# EAGLE design CortexM0 development board (EAGLE 9.6.2)
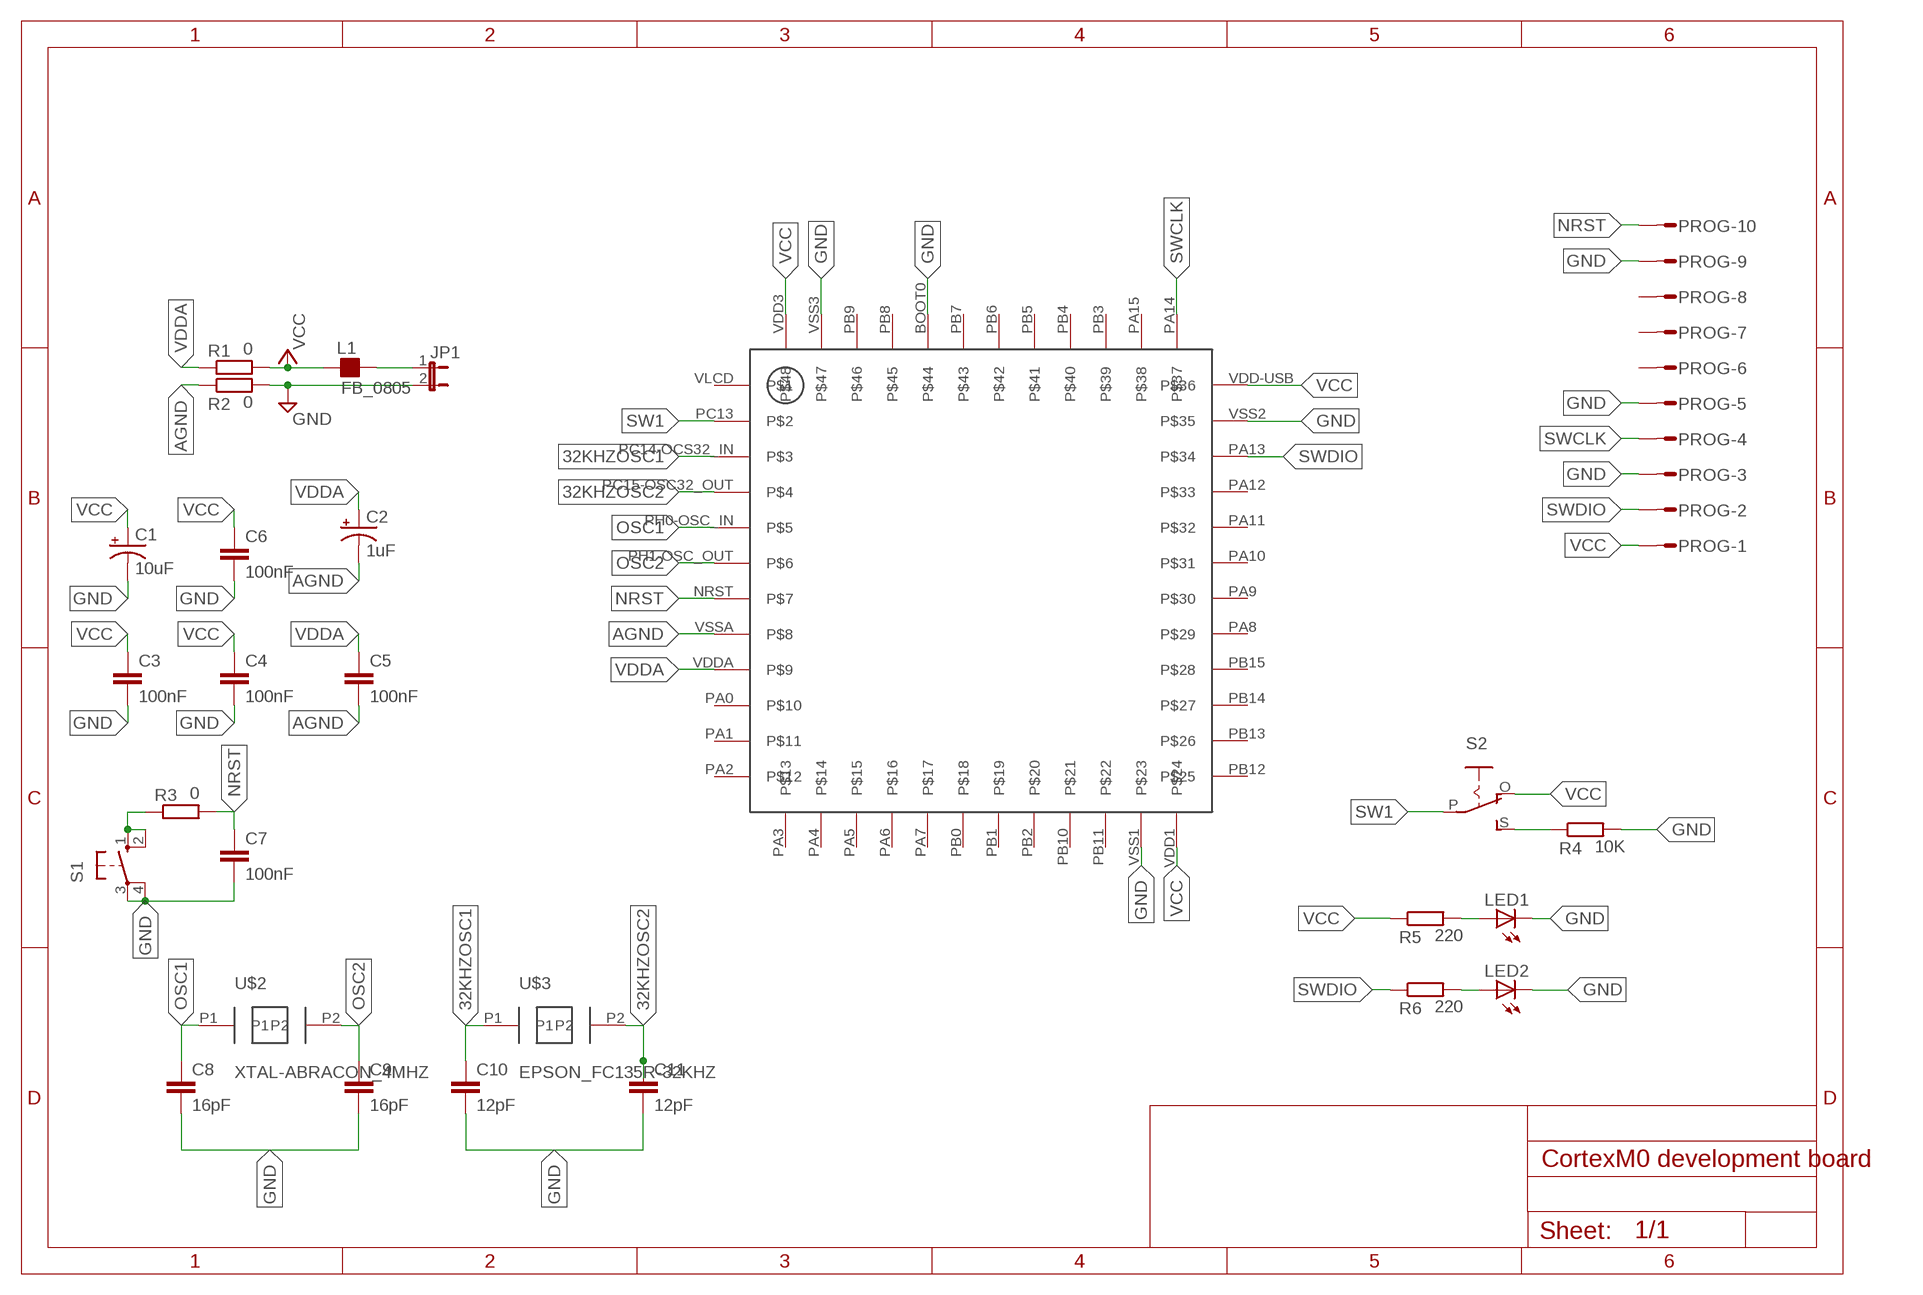
[diagram p0: schematic, sheet 1]

## Parts
C1  10uF  C-POL-US_TANTALUM-1206(3216-METRIC)  [CAPMP3216X180N]
C2  1uF  C-POL-US_TANTALUM-1206(3216-METRIC)  [CAPMP3216X180N]
C3  100nF  C-EUC0805  [C0805]
C4  100nF  C-EUC0805  [C0805]
C5  100nF  C-EUC0805  [C0805]
C6  100nF  C-EUC0805  [C0805]
C7  100nF  C-EUC0805  [C0805]
C8  16pF  C-EUC0805  [C0805]
C9  16pF  C-EUC0805  [C0805]
C10  12pF  C-EUC0805  [C0805]
C11  12pF  C-EUC0805  [C0805]
JP1  JP1E  [JP1]
L1  FB_0805  [L0805]
LED1  LED  [SMARTLED-TTW]
LED2  LED  [SMARTLED-TTW]
PROG  S10P  [S10P]
R1  0  R-EU_R0805  [R0805]
R2  0  R-EU_R0805  [R0805]
R3  0  R-EU_R0805  [R0805]
R4  10K  R-EU_R0805  [R0805]
R5  220  R-EU_R0805  [R0805]
R6  220  R-EU_R0805  [R0805]
S1  10-XX  [B3F-10XX]
S2  EG1218S  [EG1218]
U$1  LQFP_48  [STM32L083CZ]
U$2  XTAL-ABRACON_4MHZ  [XTAL_ABRACON_4MHZ]
U$3  EPSON_FC135R-32KHZ  [EPSON_FC135R_32KHZ]

## Nets
32KHZOSC1: C10.1 U$1.PC14-OCS32_IN U$3.P1
32KHZOSC2: C11.1 U$1.PC15-OSC32_OUT U$3.P2
AGND: C2.2(-) C5.2 R2.1 U$1.VSSA
GND: C1.2(-) C3.2 C4.2 C6.2 C7.2 C8.2 C9.2 C10.2 C11.2 JP1.2 LED1.C@1(C) LED2.C@1(C) PROG.3 PROG.5 PROG.9 R2.2 R4.2 S1.3(P) S1.4(P1) U$1.BOOT0 U$1.VSS1 U$1.VSS2 U$1.VSS3
N$1: JP1.1 L1.2
N$2: LED1.A@1(A) R5.2
N$3: R4.1 S2.S
N$5: R3.1 S1.1(S) S1.2(S1)
N$6: LED2.A@1(A) R6.2
NRST: C7.1 PROG.10 R3.2 U$1.NRST
OSC1: C8.1 U$1.PH0-OSC_IN U$2.P1
OSC2: C9.1 U$1.PH1-OSC_OUT U$2.P2
SW1: S2.P U$1.PC13
SWCLK: PROG.4 U$1.PA14
SWDIO: PROG.2 R6.1 U$1.PA13
VCC: C1.1(+) C3.1 C4.1 C6.1 L1.1 PROG.1 R1.2 R5.1 S2.O U$1.VDD1 U$1.VDD3 U$1.VDD-USB
VDDA: C2.1(+) C5.1 R1.1 U$1.VDDA
Unconnected: PROG.6 PROG.7 PROG.8 U$1.PA0 U$1.PA1 U$1.PA2 U$1.PA3 U$1.PA4 U$1.PA5 U$1.PA6 U$1.PA7 U$1.PA8 U$1.PA9 U$1.PA10 U$1.PA11 U$1.PA12 U$1.PA15 U$1.PB0 U$1.PB1 U$1.PB2 U$1.PB3 U$1.PB4 U$1.PB5 U$1.PB6 U$1.PB7 U$1.PB8 U$1.PB9 U$1.PB10 U$1.PB11 U$1.PB12 U$1.PB13 U$1.PB14 U$1.PB15 U$1.VLCD

## Library data of the parts
C1 C2 = Capacitor:C-POL-US: Capacitor Polarised - ANSI; CATEGORY: Capacitor
C3-C11 = rcl:C-EU: CAPACITOR, European symbol; SPICEPREFIX: C
JP1 = jumper:JP1E: JUMPER
L1 = rc-master-smd:FB_: FERRITE BEAD
LED1 LED2 = adafruit:LED: LED OSRAM: - CHIPLED LG R971, LG N971, LY N971, LG Q971, LY Q971, LO R971, LY R971 LH N974, LH R974 LS Q976, LO Q976, LY Q976 LO Q996 - Hyper CHIPLED LW Q18S LB Q993, LB Q99A, LB R99A - SideLED LS A670, LO A670, LY A670, LG A670, LP A670 LB A673, LV A673, LT A673, LW A673 LH A674 LY A675 LS A676, LA A676, LO A676, LY A676, LW A676 LS A679, LY A679, LG A679 - Hyper Micro SIDELED® LS Y876, LA Y876, LO Y876, LY Y876 LT Y87S - SmartLED LW L88C, LW L88S LB L89C, LB L89S, LG L890 LS L89K, LO L89K, LY L89K LS L896, LA L896, LO L896, LY L896 - TOPLED LS T670, LO T670, LY T670, LG T670, LP T670 LSG T670, LSP T670, LSY T670, LOP T670, LYG T670 LG T671, LOG T671, LSG T671 LB T673, LV T673, LT T673, LW T673 LH T674 LS T676, LA T676, LO T676, LY T676, LB T676, LH T676, LSB T676, LW T676 LB T67C, LV T67C, LT T67C, LS T67K, LO T67K, LY T67K, LW E67C LS E67B, LA E67B, LO E67B, LY E67B, LB E67C, LV E67C, LT E67C LW T67C LS T679, LY T679, LG T679 LS T770, LO T770, LY T770, LG T770, LP T770 LB T773, LV T773, LT T773, LW T773 LH T774 LS E675, LA E675, LY E675, LS T675 LS T776, LA T776, LO T776, LY T776, LB T776 LHGB T686 LT T68C, LB T68C - Hyper Mini TOPLED® LB M676 - Mini TOPLED Santana® LG M470 LS M47K, LO M47K, LY M47K Source: http://www.osram.convergy.de/
PROG = con-amp-mt:S10P: AMP MT CONNECTOR; OC_FARNELL: unknown; OC_NEWARK: unknown
R1-R6 = rcl:R-EU_: RESISTOR, European symbol; SPICEPREFIX: R
S1 = switch-omron:10-XX: OMRON SWITCH; MPN: B3F-1000; OC_FARNELL: 176432; OC_NEWARK: 36M3542
S2 = adafruit:EG1218: SLIDING SWITCH 0.1" spacing through hole, vertical SPDT slide switch http://www.ladyada.net/library/pcb/eaglelibrary.html
U$1 = STM32L083:LQFP_48
U$2 = Pooja_XTAL:XTAL-ABRACON_4MHZ
U$3 = Pooja_XTAL:EPSON_FC135R-32KHZ

## Board
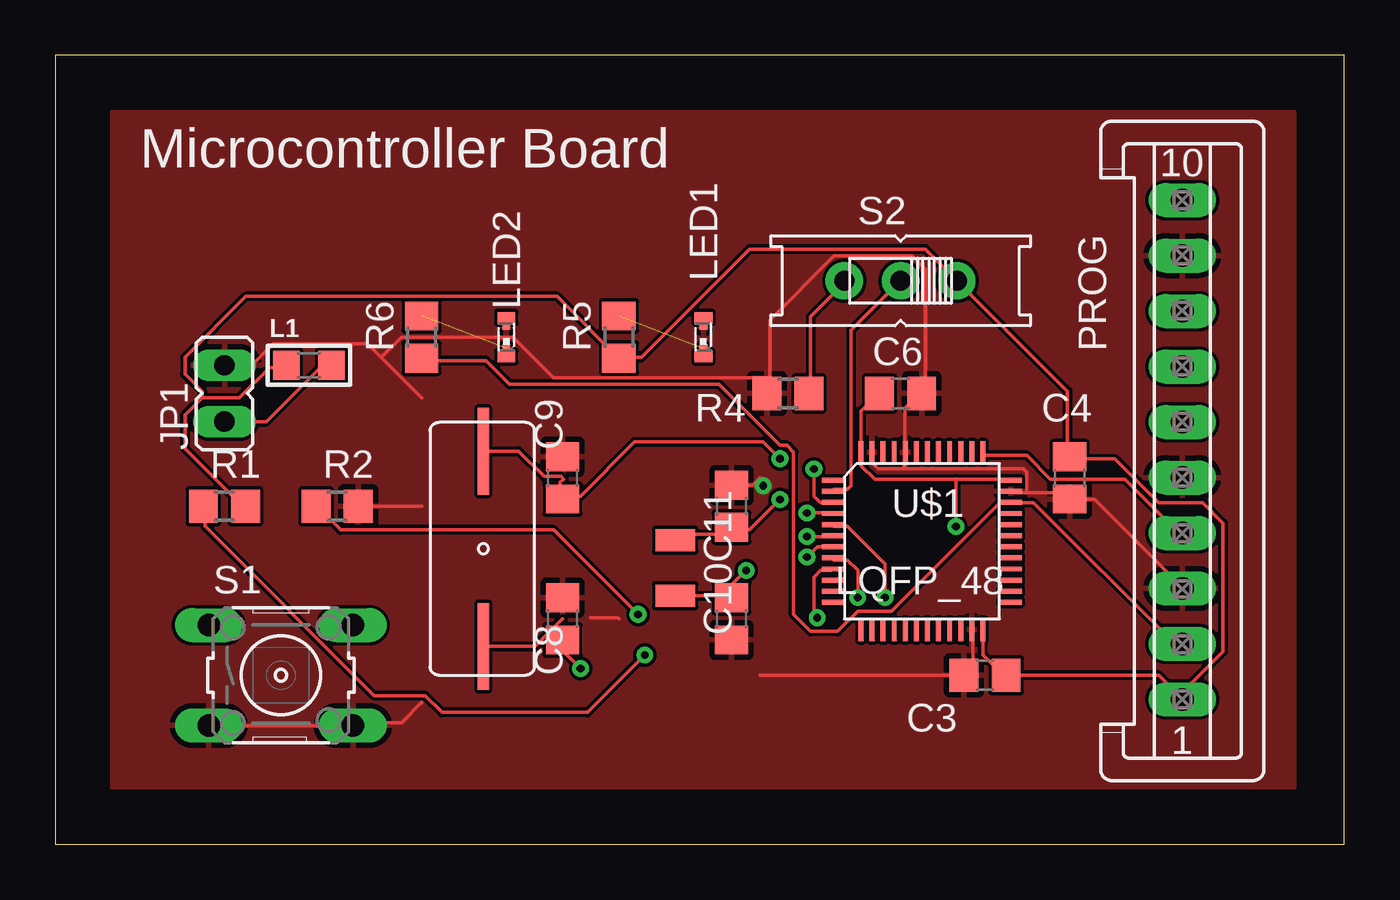
[diagram p1: board, top side]
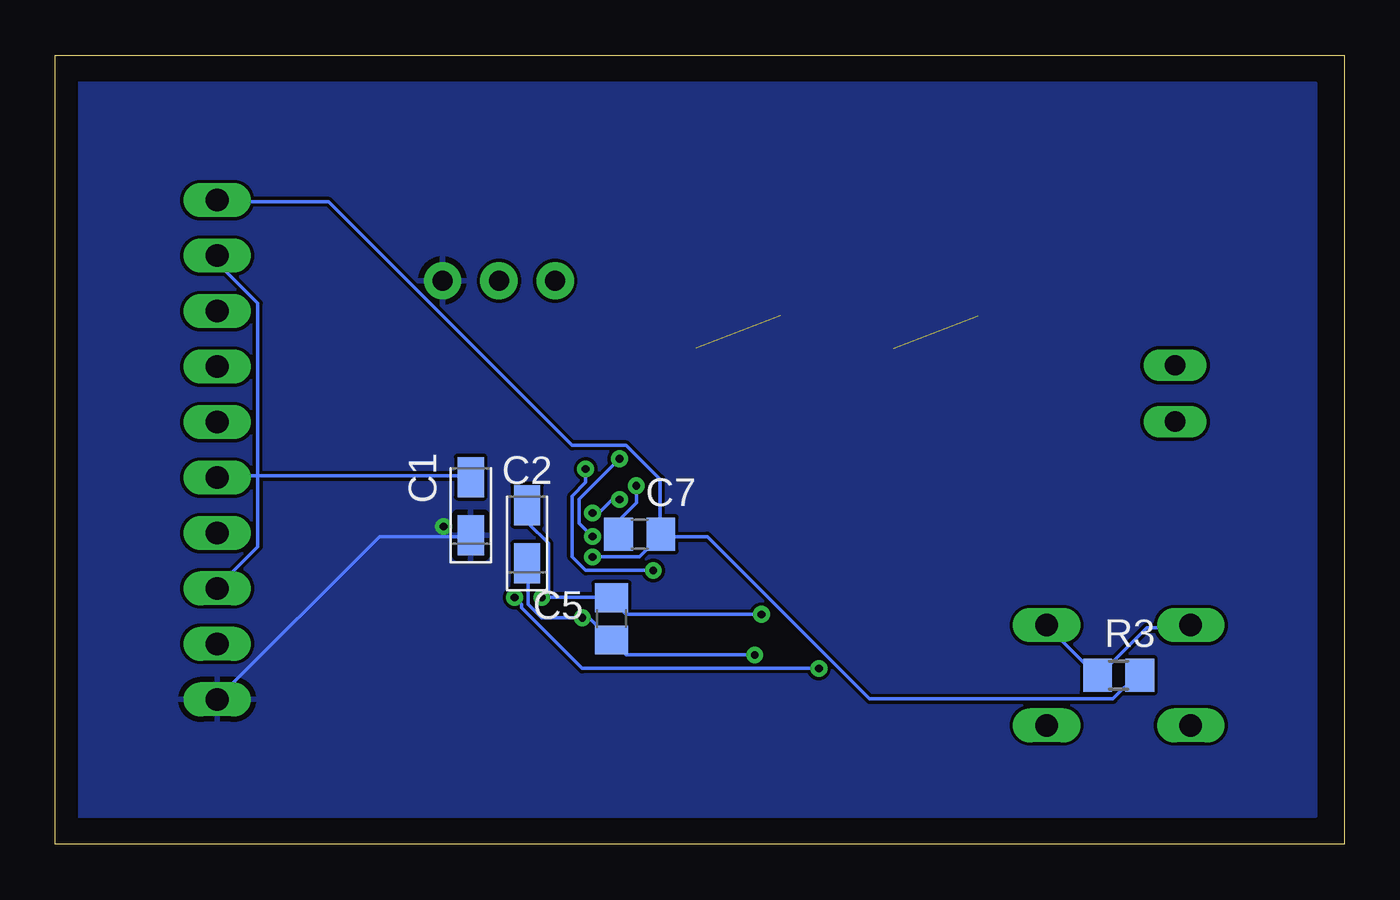
[diagram p2: board, bottom side, seen from below]

Size 58.09 x 35.55 mm. Coordinates in mm from the lower left corner, seen from the top.
Outline: 0,0 58.09,0 58.09,35.55 0,35.55 0,0
Copper layers (1*16): Top 0.035mm / dielectric 1.5mm / Bottom 0.035mm
Design rules "default": minimum track width 6mil, minimum drill 0.35mm, track to track 6mil, track to pad 6mil, pad to pad 6mil, via to via 6mil, smd to smd 6mil, copper to edge 40mil, drill to drill 6mil, minimum pad ring 10mil, minimum via ring 8mil, stop-mask expansion 4mil, vias tented up to drill 0mil, thermal gap 10mil

### Footprints (pad centres in the part's own frame; a part is rotated, then mirrored left to right if it is on the bottom)
CAPMP3216X180N = smd 1.796 x 1.189: 1 -1.31,0; 2 1.31,0
C0805 = smd 1.3 x 1.5: 1 -0.95,0; 2 0.95,0
JP1 = drill 0.914 long: 1 0,-1.27; 2 0,1.27
L0805 = smd 1.2 x 1.3: 1 -1.016,0; 2 1.016,0
SMARTLED-TTW = smd 0.8 x 0.5: A 0,-0.875; C 0,0.875 | smd 0.35 x 0.35: A@1 0,-0.5; C@1 0,0.5
S10P = drill 1.016 long: 1 11.25,0; 2 8.75,0; 3 6.25,0; 4 3.75,0; 5 1.25,0; 6 -1.25,0; 7 -3.75,0; 8 -6.25,0; 9 -8.75,0; 10 -11.25,0
R0805 = smd 1.3 x 1.5: 1 -0.95,0; 2 0.95,0
B3F-10XX = drill 1.016 long: 1 -3.251,2.261; 2 3.251,2.261; 3 -3.251,-2.261; 4 3.251,-2.261
EG1218 = drill 0.9 pad 1.676: O -2.54,0; P 0,0; S 2.54,0
STM32L083CZ = smd 0.22 x 1: BOOT0 2.75,7.5; PA3 0.75,-0.5; PA4 1.25,-0.5; PA5 1.75,-0.5; PA6 2.25,-0.5; PA7 2.75,-0.5; PA14 6.25,7.5; PA15 5.75,7.5; PB0 3.25,-0.5; PB1 3.75,-0.5; PB2 4.25,-0.5; PB3 5.25,7.5; PB4 4.75,7.5; PB5 4.25,7.5; PB6 3.75,7.5; PB7 3.25,7.5; PB8 2.25,7.5; PB9 1.75,7.5; PB10 4.75,-0.5; PB11 5.25,-0.5; VDD1 6.25,-0.5; VDD3 0.75,7.5; VSS1 5.75,-0.5; VSS3 1.25,7.5 | smd 1 x 0.22: NRST -0.5,3.25; PA0 -0.5,1.75; PA1 -0.5,1.25; PA2 -0.5,0.75; PA8 7.5,2.75; PA9 7.5,3.25; PA10 7.5,3.75; PA11 7.5,4.25; PA12 7.5,4.75; PA13 7.5,5.25; PB12 7.5,0.75; PB13 7.5,1.25; PB14 7.5,1.75; PB15 7.5,2.25; PC13 -0.5,5.75; PC14-OCS32_IN -0.5,5.25; PC15-OSC32_OUT -0.5,4.75; PH0-OSC_IN -0.5,4.25; PH1-OSC_OUT -0.5,3.75; VDD-USB 7.5,6.25; VDDA -0.5,2.25; VLCD -0.5,6.25; VSS2 7.5,5.75; VSSA -0.5,2.75
XTAL_ABRACON_4MHZ = smd 3.91 x 0.5: P1 1.3,2.3; P2 10.1,2.3
EPSON_FC135R_32KHZ = smd 1 x 1.8: P1 -1.5,0; P2 1,0

### Placement (x,y rotation side)
C1  39.37,15.24 90 bottom
C2  36.83,13.97 90 bottom
C3  41.91,7.62 180 top
C4  45.72,16.51 270 top
C5  33.02,10.16 90 bottom
C6  38.1,20.32 0 top
C7  31.75,13.97 180 bottom
C8  22.86,10.16 90 top
C9  22.86,16.51 90 top
C10  30.48,10.16 270 top
C11  30.48,15.24 90 top
JP1  7.62,20.32 0 top
L1  11.43,21.59 0 top
LED1  29.21,22.86 0 top
LED2  20.32,22.86 0 top
PROG  50.8,17.78 270 top
R1  7.62,15.24 0 top
R2  12.7,15.24 0 top
R3  10.16,7.62 0 bottom
R4  33.02,20.32 180 top
R5  25.4,22.86 90 top
R6  16.51,22.86 90 top
S1  10.16,7.62 0 top
S2  38.1,25.4 180 top
U$1  35.56,10.16 0 top
U$2  21.59,7.62 90 top
U$3  27.94,12.7 90 top

### Tracks (layer width: path | path; a pad name or v marks a point on that pad's centre or on a via)
32KHZOSC1  (via drill 0.35)
  Top 0.152: U$3.P1 30.39,11.2 C10.1 30.53,11.12 30.53,11.74 v31.14,12.34 | v34.19,16.92 34.19,15.7 34.49,15.39 34.95,15.39 U$1.PC14-OCS32_IN
  Bottom 0.152: v34.19,16.92 34.19,16.31 34.8,15.7 34.8,12.95 34.19,12.34 v31.14,12.34
32KHZOSC2  (via drill 0.35)
  Top 0.152: U$3.P2 28.21,13.97 30.38,13.97 | 30.38,13.97 30.48,13.97 | v33.88,14.93 34.95,14.93 U$1.PC15-OSC32_OUT | v32.66,15.54 31.29,14.17 30.53,14.17 C11.1 30.38,14.17 30.38,13.97
  Bottom 0.152: v33.88,14.93 33.58,14.93 32.97,15.54 v32.66,15.54
AGND  (via drill 0.35)
  Top 0.152: v36.17,11.12 36.17,12.34 35.71,12.8 35.1,12.8 U$1.VSSA | v26.26,10.36 22.45,14.17 12.85,14.17 11.79,15.24 R2.1
  Bottom 0.152: 35.86,11.12 33.12,11.12 C5.2 32.97,10.97 32.36,10.36 v26.26,10.36 | 35.86,11.12 35.86,13.56 36.78,14.48 36.78,15.24 C2.2 | 35.86,11.12 v36.17,11.12
GND  (via drill 0.35)
  Top 0.152: C11.2 31.43,16.19 31.75,16.51 | 43.79,15.85 45.47,15.85 45.62,15.7 C4.2 45.77,15.54 46.84,15.54 50.8,11.58 PROG.3 | 43.79,15.85 43.18,15.85 U$1.VSS2 | 38.15,16.92 37.08,16.92 36.78,17.22 36.78,17.53 U$1.VSS3 | 38.15,16.92 38.3,17.07 38.3,17.53 U$1.BOOT0 38.3,17.68 38.3,19.66 38.91,20.27 C6.2 39.06,20.42 39.22,20.57 39.22,25.91 38.61,26.52 35.1,26.52 32.21,23.62 32.21,21.03 | 32.21,21.03 32.21,20.42 R4.2 32.21,21.03 | 43.79,15.85 43.79,16.76 43.64,16.92 38.15,16.92 | S1.3 6.91,5.33 13.31,5.33 S1.4 13.46,5.49 15.6,5.49 16.51,6.4 16.51,6.35 | U$1.VSS1 41.35,9.6 41.35,7.93 41.05,7.62 C3.2 31.75,7.62 | 31.75,16.15 v31.9,16.15 | 16.51,15.24 R2.2 | 24.13,10.21 25.35,10.21 25.4,10.16 | 16.51,20.12 14.68,21.95 | 14.68,21.95 14.07,22.55 9.8,22.55 8.89,21.64 7.67,21.64 JP1.2 | 32.21,21.03 22.45,21.03 20.63,22.86 15.6,22.86 14.68,21.95
  Bottom 0.152: 48.97,16.61 50.8,16.61 PROG.5 | 48.97,16.61 39.37,16.61 C1.2 | 48.97,16.61 48.97,13.41 50.8,11.58 PROG.3 | PROG.9 50.8,26.21 48.97,24.38 48.97,16.61 | v31.9,16.15 31.9,15.39 32.66,14.63 32.66,14.02 C7.2
  pour Top: 16.51,20.32 22.86,20.32 24.13,19.05 24.13,8.89 24.13,7.62 22.86,6.35 16.51,6.35
  pour Top: 25.4,15.24 27.94,17.78 31.75,17.78 31.75,7.62 27.94,7.62 25.4,10.16
  pour Top: 2.54,33.02 55.88,33.02 55.88,2.54 2.54,2.54
N$1
  Top 0.152: JP1.1 9.5,19.05 11.94,21.49 12.39,21.49 L1.2
N$2  (1 unrouted)
N$3
  Top 0.152: R4.1 34.04,20.42 34.04,23.77 35.56,25.3 S2.S
N$5
  Bottom 0.152: S1.2 13.31,9.75 11.18,7.62 R3.1 11.02,7.62 8.89,9.75 6.91,9.75 S1.1
N$6  (1 unrouted)
NRST  (via drill 0.35)
  Top 0.152: v33.88,12.95 34.34,13.41 34.95,13.41 U$1.NRST
  Bottom 0.152: v33.88,12.95 31.75,12.95 30.84,13.87 C7.1 | R3.2 9.35,7.62 10.41,6.55 21.39,6.55 28.7,13.87 30.68,13.87 C7.1 | PROG.10 50.8,28.96 45.77,28.96 34.8,17.98 32.36,17.98 30.84,16.46 30.84,14.02 C7.1
OSC1  (via drill 0.35)
  Top 0.152: U$2.P1 21.62,8.92 22.3,9.6 | 22.3,9.6 22.86,10.16 | v37.39,11.12 37.39,12.65 35.71,14.33 35.1,14.33 U$1.PH0-OSC_IN | v23.67,7.93 22.91,8.69 22.91,9.14 C8.1 22.76,9.14 22.3,9.6
  Bottom 0.152: v37.39,11.12 37.08,10.82 37.08,10.67 34.34,7.93 v23.67,7.93
OSC2  (via drill 0.35)
  Top 0.152: U$2.P2 20.88,17.72 22.01,16.58 22.79,16.58 22.91,16.46 22.76,16.31 22.76,15.7 C9.1 22.91,15.7 23.67,15.7 26.11,18.14 31.9,18.14 v32.66,17.37 | v33.88,13.87 34.95,13.87 U$1.PH1-OSC_OUT
  Bottom 0.152: v33.88,13.87 34.49,14.48 34.49,15.54 v32.66,17.37
SW1
  Top 0.152: S2.P 35.86,23.17 35.86,16.15 35.71,16 35.1,16 U$1.PC13
SWCLK
  Top 0.152: U$1.PA14 41.81,17.53 43.79,17.53 44.86,16.46 48.21,16.46 50.49,14.17 50.8,14.17 PROG.4
SWDIO
  Top 0.152: PROG.2 50.8,9.14 50.34,9.14 44.09,15.39 43.18,15.39 U$1.PA13 43.03,15.39 42.57,15.39 37.69,10.52 36.17,10.52 35.25,9.6 34.04,9.6 33.27,10.36 33.27,17.68 32.97,17.98 32.66,17.98 29.92,20.73 20.47,20.73 19.41,21.79 16.51,21.79 R6.1
VCC  (via drill 0.35)
  Top 0.152: C6.1 37.08,20.27 36.32,19.51 36.32,17.68 U$1.VDD3 36.32,17.53 36.32,17.07 36.93,16.46 40.59,16.46 | 40.59,16.46 43.03,16.46 U$1.VDD-USB | U$1.VDD1 41.81,9.6 41.81,8.53 42.72,7.62 C3.1 49.73,7.62 50.65,6.71 | 50.65,6.71 50.8,6.55 PROG.1 50.65,6.71 | v40.59,14.33 40.59,16.46 | 6.6,20.12 8.28,20.12 9.65,21.49 10.41,21.49 L1.1 | 6.6,20.12 5.84,19.36 5.84,17.83 8.43,15.24 R1.2 | 6.6,20.12 6.6,20.42 5.84,21.18 5.84,21.95 8.59,24.69 22.61,24.69 25.35,21.95 R5.1 25.5,21.95 26.42,21.95 31.29,26.82 39.22,26.82 S2.O 45.62,20.42 45.62,17.53 C4.1 45.77,17.37 47.75,17.37 49.73,15.39 51.71,15.39 52.63,14.48 52.63,8.69 50.65,6.71
  Bottom 0.152: 40.59,13.87 43.48,13.87 50.8,6.55 PROG.1 | 40.59,13.87 39.37,13.87 C1.1 | 40.59,13.87 v40.59,14.33
  pour Bottom: 1.27,1.27 1.27,34.29 57.15,34.29 57.15,1.27
VDDA  (via drill 0.35)
  Top 0.152: v34.34,10.21 34.19,10.36 34.19,12.04 34.49,12.34 34.95,12.34 U$1.VDDA | v26.57,8.53 23.98,5.94 17.42,5.94 16.66,6.71 14.38,6.71 6.76,14.33 6.76,15.24 R1.1
  Bottom 0.152: v26.57,8.53 32.36,8.53 32.97,9.14 C5.1 33.12,9.3 34.04,10.21 v34.34,10.21 36.17,10.21 36.78,10.82 36.78,12.65 C2.1

### Text on the board
tPlace: Microcontroller Board